# Altium schematic sheet Hydrophone.SchDoc
size 508 x 241 mm
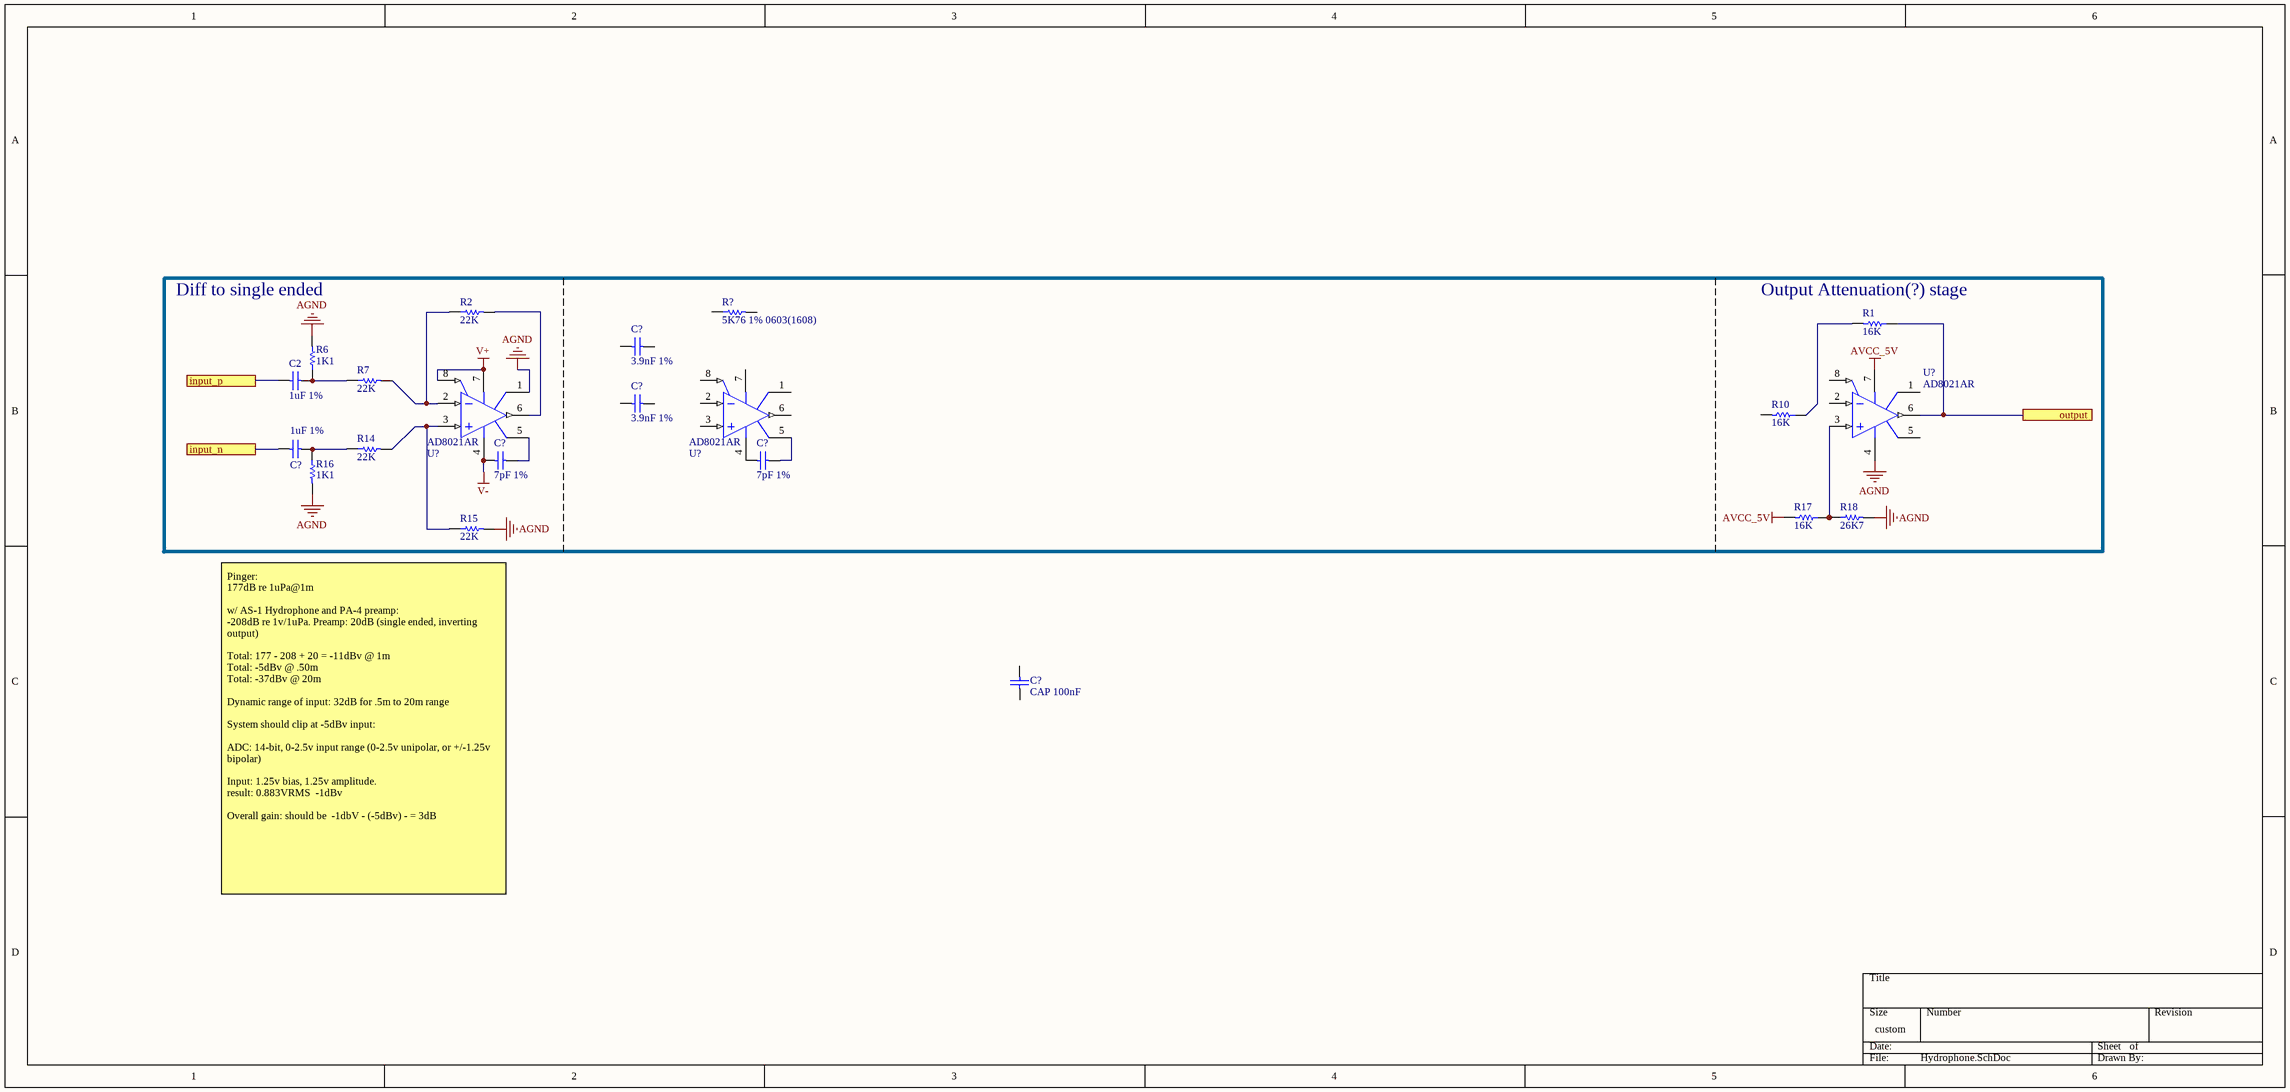
[diagram p0: Hydrophone.SchDoc]

## Parts
(Parts that share a designator on the sheet are numbered #1, #2 ... from top to bottom, then left to right.)
C2  1uF 1%  [CAPC0603(1608)100_N]
C?#1  3.9nF 1%  [CAPC0603(1608)100_L]
C?#2  3.9nF 1%  [CAPC0603(1608)100_L]
C?#3  1uF 1%  [CAPC0603(1608)100_N]
C?#4  7pF 1%  [CAPC0603(1608)100_L]
C?#5  7pF 1%  [CAPC0603(1608)100_L]
C?#6  CAP 100nF  [CAPC0603(1608)100_M]
R1  16K  [RESC0603(1608)_M]
R2  22K  [RESC0603(1608)_L]
R6  1K1  [RESC0603(1608)_N]
R7  22K  [RESC0603(1608)_L]
R10  16K  [RESC0603(1608)_M]
R14  22K  [RESC0603(1608)_L]
R15  22K  [RESC0603(1608)_L]
R16  1K1  [RESC0603(1608)_N]
R17  16K  [RESC0603(1608)_M]
R18  26K7  [RESC0603(1608)_N]
R?  5K76 1% 0603(1608)  [RESC0603(1608)_M]
U?#1  AD8021AR  [ADI-R-8_M]
U?#2  AD8021AR  [ADI-R-8_M]
U?#3  AD8021AR  [ADI-R-8_M]

## Ports
input_n, input_p, output

## Nets
AGND: R6.2 R15.2 R16.2 R18.2 U?#1.1(LOGIC_REFERENCE) U?#3.4(-VS)
AVCC_5V: R17.2 U?#3.7(+VS)
V+: U?#1.7(+VS) U?#1.8(~{DISABLE})
V-: C?#4.1 U?#1.4(-VS)
input_n: C?#3.1 ; port input_n
input_p: C2.1 ; port input_p
output: R1.1 U?#3.6(VOUT) ; port output
NetC2_2: C2.2 R6.1 R7.1
NetC?#3_2: C?#3.2 R14.1 R16.1
NetC?#4_2: C?#4.2 U?#1.5(CCOMP)
NetC?#5_1: C?#5.1 U?#2.4(-VS)
NetC?#5_2: C?#5.2 U?#2.5(CCOMP)
NetR1_2: R1.2 R10.1
NetR2_1: R2.1 R7.2 U?#1.2(-IN)
NetR2_2: R2.2 U?#1.6(VOUT)
NetR14_2: R14.2 R15.1 U?#1.3(+IN)
NetR17_1: R17.1 R18.1 U?#3.3(+IN)

Not connected (* = marked no-connect by the designer): C?#1 1 2; C?#2 1 2; C?#6 1 2; R10 2; R? 1 2; U?#2 1(LOGIC_REFERENCE) 2(-IN) 3(+IN) 6(VOUT) 7(+VS) 8(~{DISABLE}); U?#3 1(LOGIC_REFERENCE) 2(-IN) 5(CCOMP) 8(~{DISABLE})

## Notes on the sheet
- Diff to single ended
- (near R1) Output Attenuation(?) stage
- (near R15) Pinger:
  177dB re 1uPa@1m
  w/ AS-1 Hydrophone and PA-4 preamp:
  -208dB re 1v/1uPa. Preamp: 20dB (single ended, inverting output)
  Total: 177 - 208 + 20 = -11dBv @ 1m
  Total: -5dBv @ .50m
  Total: -37dBv @ 20m
  Dynamic range of input: 32dB for .5m to 20m range
  System should clip at -5dBv input:
  ADC: 14-bit, 0-2.5v input range (0-2.5v unipolar, or +/-1.25v bipolar)
  Input: 1.25v bias, 1.25v amplitude.
  result: 0.883VRMS  -1dBv
  Overall gain: should be  -1dbV - (-5dBv) - = 3dB

## Library data of the parts
C2 C?#3 = CMP-1035-02736-1: CAP 1uF 16V ±5% 0603 (1608 Metric) Thickness 1mm SMD; Case-Metric: 1608; Case-EIA: 0603; Tolerance: Â±5%; Technology: SMT; Max Thickness: 1 mm; Rated Voltage: 16 V; Value: 1uF
C?#1 C?#2 = CMP-1035-02156-1: CAP 3.9nF 25V ±1% 0603 (1608 Metric) Thickness 1mm SMD; Tolerance: Â±1%; Case-EIA: 0603; Case-Metric: 1608; Max Thickness: 1 mm; Value: 3.9nF; Rated Voltage: 25 V; Technology: SMT
C?#4 C?#5 = CMP-1035-00450-1: CAP 7pF 50V ±0.5pF 0603 (1608 Metric) Thickness 1mm SMD; Tolerance: Â±0.5pF; Case-EIA: 0603; Case-Metric: 1608; Max Thickness: 1 mm; Technology: SMT; Value: 7pF; Rated Voltage: 50 V
C?#6 = CMP-1035-02583-1: CAP 100nF 16V ±5% 0603 (1608 Metric) Thickness 1mm SMD; Tolerance: Â±5%; Case-Metric: 1608; Case-EIA: 0603; Rated Voltage: 16 V; Max Thickness: 1 mm; Technology: SMT; Value: 100nF
R1 R10 R17 = CMP-1012-00644-1: 16K 0.1W 1% 0603 (1608 Metric)  SMD; Value: 16000.00 Ohm; Case-Metric: 1608; Case-EIA: 0603; Technology: SMT; Tolerance: 1 %; Power: 0.1 W
R2 R7 R14 R15 = CMP-1012-00659-1: 22K 0.1W 1% 0603 (1608 Metric)  SMD; Case-EIA: 0603; Value: 22000.00 Ohm; Case-Metric: 1608; Technology: SMT; Power: 0.1 W; Tolerance: 1 %
R6 R16 = CMP-1012-00514-1: 1K1 0.1W 1% 0603 (1608 Metric)  SMD; Case-Metric: 1608; Case-EIA: 0603; Value: 1100.00 Ohm; Technology: SMT; Tolerance: 1 %; Power: 0.1 W
R18 = CMP-1012-00669-1: 26K7 0.1W 1% 0603 (1608 Metric)  SMD; Value: 26700.00 Ohm; Case-Metric: 1608; Case-EIA: 0603; Power: 0.1 W; Technology: SMT; Tolerance: 1 %
R? = CMP-1012-00596-1: 5K76 0.1W 1% 0603 (1608 Metric)  SMD; Case-EIA: 0603; Case-Metric: 1608; Value: 5760.00 Ohm; Tolerance: 1 %; Power: 0.1 W; Technology: SMT
U?#1-U?#3 = CMP-0384-00643-2: Single Channel Low Power Operational Amplifier, 490 MHz BW, 120 V/us SR, Industrial, 8-pin SOIC (R-8), Tube; Generic Part Number: AD8021; Manufacturer: Analog Devices; Input Bias Current: 7.5uA; Iq/Amp: 7.7mA; Input Offset Voltage: 400uV; Small Signal Bandwidth: 490MHz; V Span Min: 4.5V; V Span Max: 24V; Amplifiers Per Package: 1; ComponentLink4URL: http://www.analog.com/en/all-operational-amplifiers-op-amps/operational-amplifiers-op-amps/ad8021/products/product.html#product-recommendations; ComponentLink3URL: http://www.analog.com/static/imported-files/packages/PKG_PDF/SOIC_Narrow%20(R)/R_8.pdf; PackageDescription: 8-Pin Standard Small Outline Package, Body 3.9 x 4.9 mm, Pitch 1.27 mm; Slew Rate: 120V/us; PackageVersion: 060506-A; ComponentLink4Description: Reference Circuit; PartNumber: AD8021AR; ComponentLink1Description: Manufacturer URL; Code_JEDEC: MS-012-AA; RevisionNote: Reference Circuit URL fixed; ComponentLink3Description: Package Specification; PackageReference: R-8; DatasheetVersion: Rev. F; ComponentLink1URL: http://www.analog.com/en/index.html; Mounting Technology: Surface Mount; ComponentLink2Description: Datasheet; ComponentLink2URL: http://www.analog.com/static/imported-files/data_sheets/AD8021.pdf